# Altium project OTTO_ESP32.PrjPCB
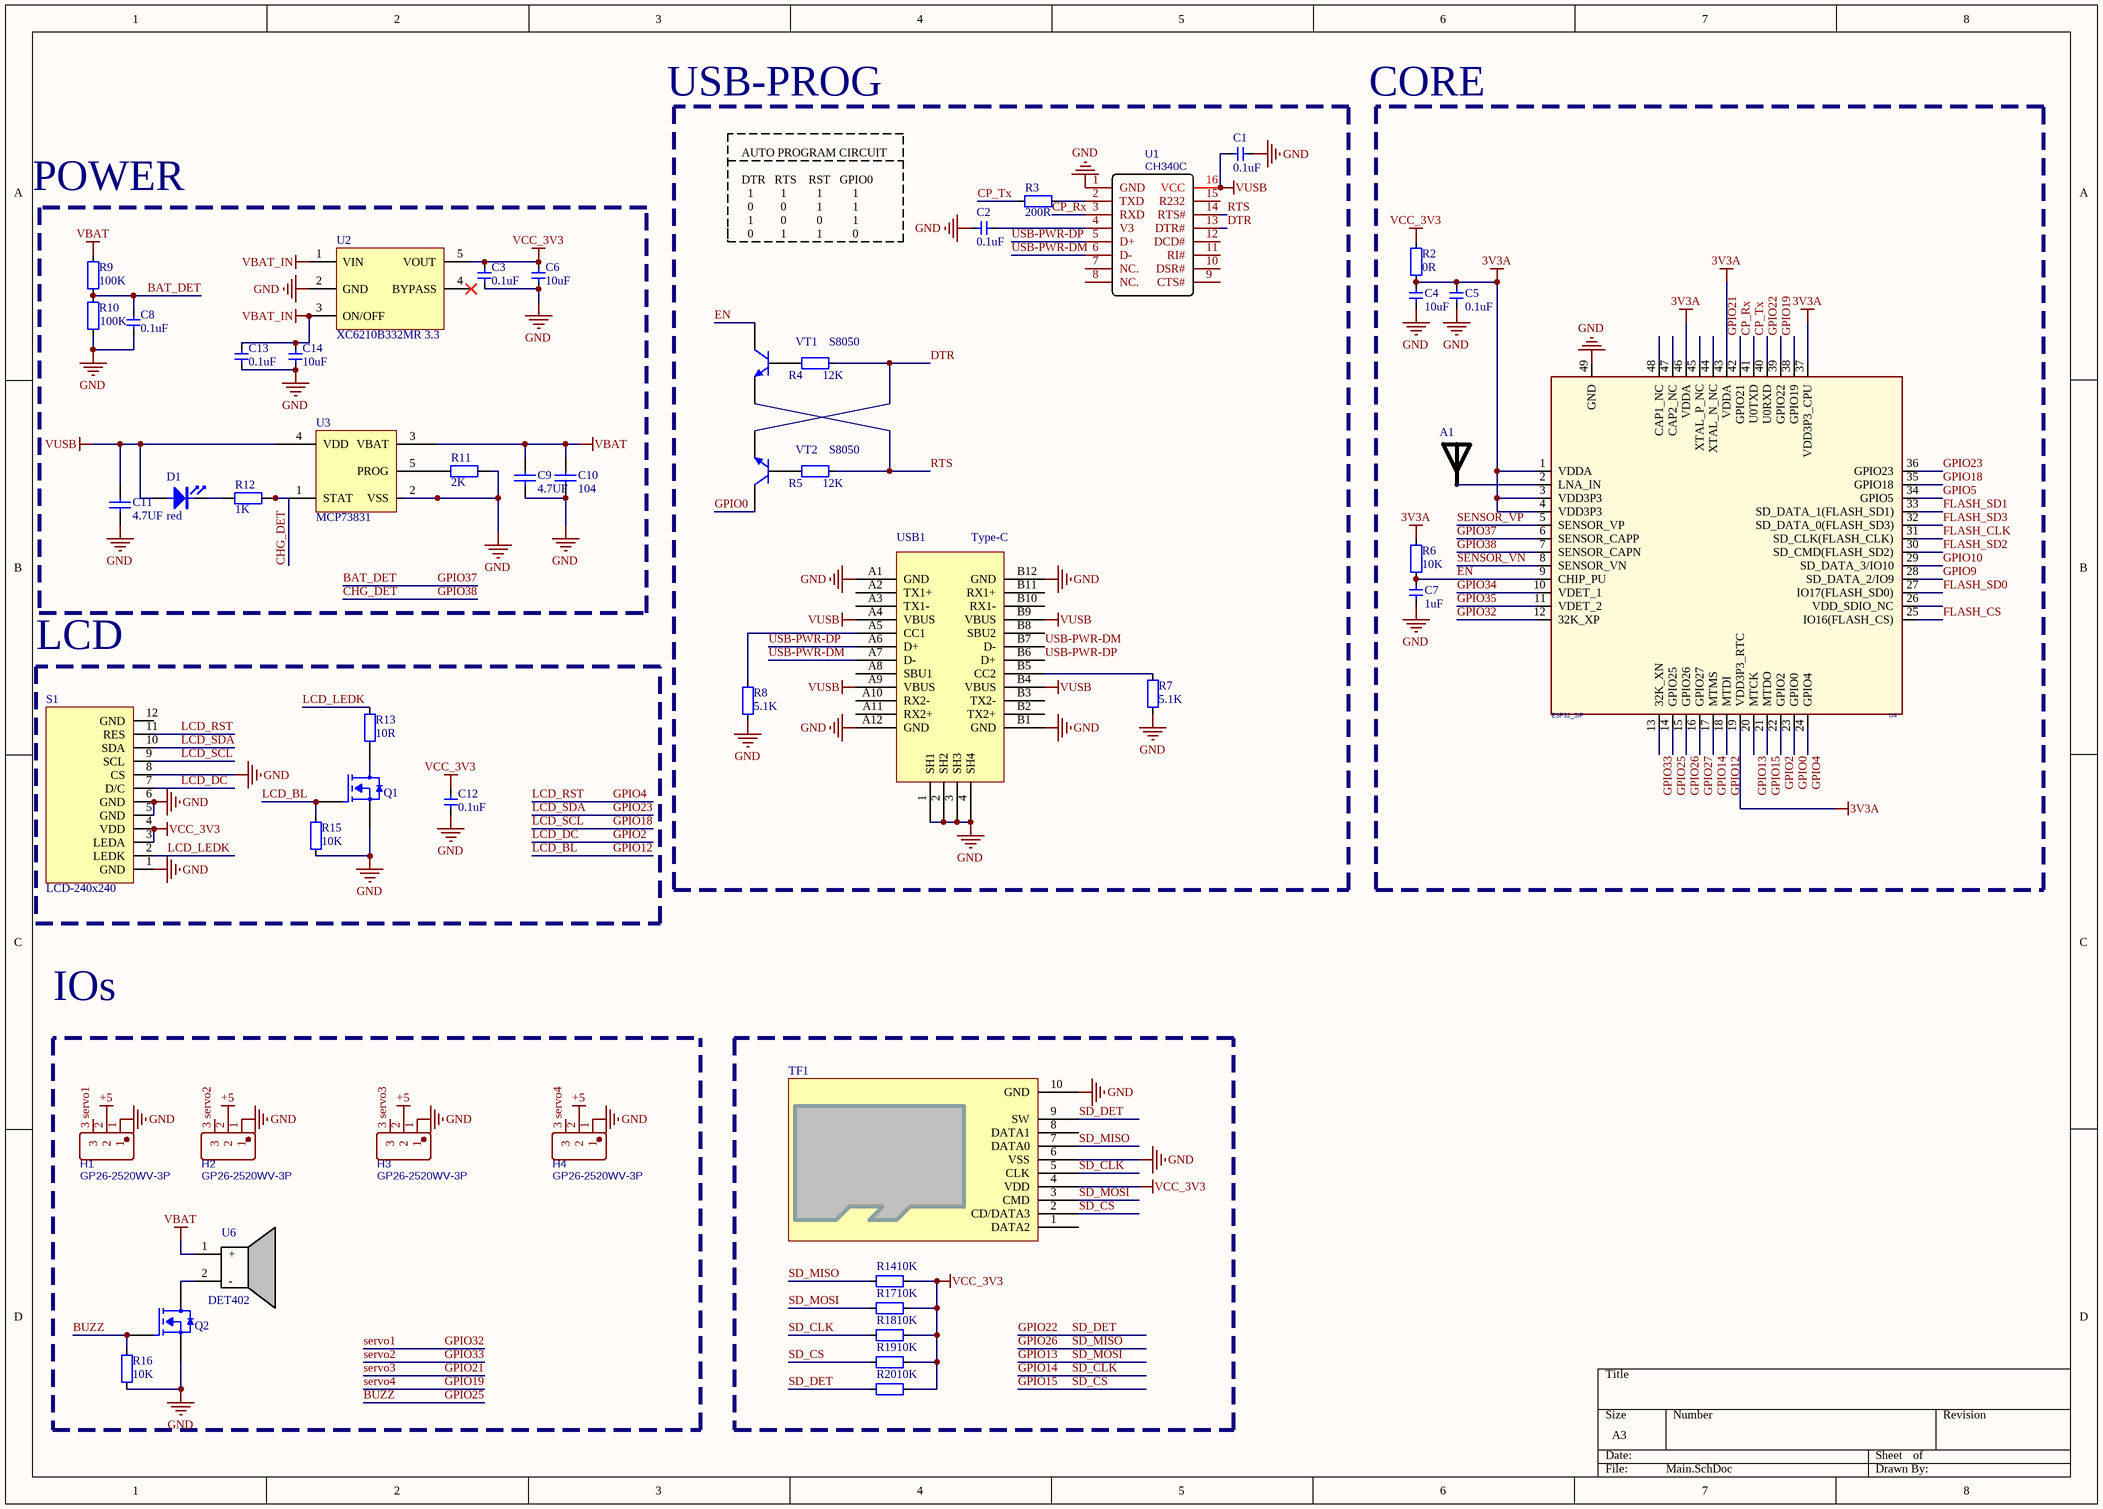
[diagram p0: Main.SchDoc]
1 sheet, 51 parts. Net scope: global (net labels, ports and power ports of the same name join across sheets).
Board file: OTTO_ESP32.PcbDoc

## Sheet Main.SchDoc
size A3

### Parts
A1  RAINSUN  [ANT-Rainsun-AN5120]  (value not drawn)
C1  0.1uF  [C0603]
C2  0.1uF  [C0603]
C3  0.1uF  [C0603]
C4  10uF  [C0603]
C5  0.1uF  [C0603]
C6  10uF  [C0603]
C7  1uF  [C0603]
C8  0.1uF  [C0603]
C9  4.7UF  [C0603]
C10  104  [C0603]
C11  4.7UF  [C0603]
C12  0.1uF  [C0603]
C13  0.1uF  [C0603]
C14  10uF  [C0603]
D1  red  [LED0603]
H1  GP26-2520WV-3P  [PIN2.54_1*3]
H2  GP26-2520WV-3P  [PIN2.54_1*3]
H3  GP26-2520WV-3P  [PIN2.54_1*3]
H4  GP26-2520WV-3P  [PIN2.54_1*3]
Q1  AO3400A  [SOT23-3]  (value not drawn)
Q2  AO3400A  [SOT23-3]  (value not drawn)
R2  0R  [R0603]
R3  200R  [R0603]
R4  12K  [R0603]
R5  12K  [R0603]
R6  10K  [R0603]
R7  5.1K  [R0603]
R8  5.1K  [R0603]
R9  100K  [R0603]
R10  100K  [R0603]
R11  2K  [R0603]
R12  1K  [R0603]
R13  10R  [R0603]
R14  10K  [R0603]
R15  10K  [R0603]
R16  10K  [R0603]
R17  10K  [R0603]
R18  10K  [R0603]
R19  10K  [R0603]
R20  10K  [R0603]
S1  LCD-240x240  [LCD-240x240-FlUSH-154]
TF1  TF  [TF-SOCKET]  (value not drawn)
U1  CH340C  [SOP-16_L10.0-W3.9-P1.27-LS6.0-BL]
U2  XC6210B332MR 3.3  [SOT23-5]
U3  MCP73831  [SOT23-5]
U4  ESP32_SIP  [QFN-48_7X7]
U6  DET402  [DET402]
USB1  Type-C  [Type-C-TOP]
VT1  S8050  [SOT23-3]
VT2  S8050  [SOT23-3]

### Nets
3V3A: C4.2 C5.2 R2.2 R6.1 U4.1(VDDA) U4.3(VDD3P3) U4.4(VDD3P3) U4.19(VDD3P3_RTC) U4.37(VDD3P3_CPU) U4.43(VDDA) U4.46(VDDA)
+5: H1.2 H2.2 H3.2 H4.2
GND: C1.1 C2.2 C3.1 C4.1 C5.1 C6.1 C7.2 C8.1 C9.1 C10.2 C11.1 C12.1 C13.1 C14.1 H1.1 H2.1 H3.1 H4.1 Q1.2(S) Q2.2(S) R7.2 R8.2 R10.1 R11.1 R15.1 R16.1 S1.1(GND) S1.5(GND) S1.6(GND) S1.8(CS) TF1.6(VSS) TF1.10(GND) U1.1(GND) U2.2(GND) U3.2(VSS) U4.49(GND) USB1.1(SH1) USB1.2(SH2) USB1.3(SH3) USB1.4(SH4) USB1.A1(GND) USB1.A12(GND) USB1.B1(GND) USB1.B12(GND)
VBAT: C9.2 C10.1 R9.2 U3.3(VBAT) U6.1(+)
VBAT_IN: C13.2 C14.2 U2.1(VIN) U2.3(ON/OFF)
VCC_3V3: C3.2 C6.2 C12.2 R2.1 R14.1 R17.1 R18.1 R19.1 R20.1 S1.3(LEDA) S1.4(VDD) TF1.4(VDD) U2.5(VOUT)
VUSB: C1.2 C11.2 D1.A U1.16(VCC) U3.4(VDD) USB1.A4(VBUS) USB1.A9(VBUS) USB1.B4(VBUS) USB1.B9(VBUS)
BAT_DET: C8.2 R9.1 R10.2 U4.6(SENSOR_CAPP)  [also labelled GPIO37]
BUZZ: Q2.1(G) R16.2 U4.14(GPIO25)  [also labelled GPIO25]
CHG_DET: R12.1 U3.1(STAT) U4.7(SENSOR_CAPN)  [also labelled GPIO38]
CP_Rx: U1.3(RXD) U4.41(U0TXD)
CP_Tx: R3.1 U4.40(U0RXD)
DTR: R4.1 U1.13(DTR#) VT2.2(E)
EN: C7.1 R6.2 U4.9(CHIP_PU) VT1.3(C)
FLASH_CLK: U4.31(SD_CLK(FLASH_CLK))
FLASH_CS: U4.25(IO16(FLASH_CS))
FLASH_SD0: U4.27(IO17(FLASH_SD0))
FLASH_SD1: U4.33(SD_DATA_1(FLASH_SD1))
FLASH_SD2: U4.30(SD_CMD(FLASH_SD2))
FLASH_SD3: U4.32(SD_DATA_0(FLASH_SD3))
GPIO0: U4.23(GPIO0) VT2.3(C)
GPIO2: S1.7(D/C) U4.22(GPIO2)  [also labelled LCD_DC]
GPIO4: S1.11(RES) U4.24(GPIO4)  [also labelled LCD_RST]
GPIO5: U4.34(GPIO5)
GPIO9: U4.28(SD_DATA_2/IO9)
GPIO10: U4.29(SD_DATA_3/IO10)
GPIO12: Q1.1(G) R15.2 U4.18(MTDI)  [also labelled LCD_BL]
GPIO13: R17.2 TF1.3(CMD) U4.20(MTCK)  [also labelled SD_MOSI]
GPIO14: R18.2 TF1.5(CLK) U4.17(MTMS)  [also labelled SD_CLK]
GPIO15: R19.2 TF1.2(CD/DATA3) U4.21(MTDO)  [also labelled SD_CS]
GPIO18: S1.9(SCL) U4.35(GPIO18)  [also labelled LCD_SCL]
GPIO19: H4.3 U4.38(GPIO19)  [also labelled servo4]
GPIO21: H3.3 U4.42(GPIO21)  [also labelled servo3]
GPIO22: R20.2 TF1.9(SW) U4.39(GPIO22)  [also labelled SD_DET]
GPIO23: S1.10(SDA) U4.36(GPIO23)  [also labelled LCD_SDA]
GPIO26: R14.2 TF1.7(DATA0) U4.15(GPIO26)  [also labelled SD_MISO]
GPIO27: U4.16(GPIO27)
GPIO32: H1.3 U4.12(32K_XP)  [also labelled servo1]
GPIO33: H2.3 U4.13(32K_XN)  [also labelled servo2]
GPIO34: U4.10(VDET_1)
GPIO35: U4.11(VDET_2)
LCD_LEDK: R13.2 S1.2(LEDK)
RTS: R5.1 U1.14(RTS#) VT1.2(E)
SENSOR_VN: U4.8(SENSOR_VN)
SENSOR_VP: U4.5(SENSOR_VP)
USB-PWR-DM: U1.6(D-) USB1.A7(D-) USB1.B7(D-)
USB-PWR-DP: U1.5(D+) USB1.A6(D+) USB1.B6(D+)
NetA1_1: A1.1 U4.2(LNA_IN)
NetC2_1: C2.1 U1.4(V3)
NetD1_K: D1.K R12.2
NetQ1_3: Q1.3(D) R13.1
NetQ2_3: Q2.3(D) U6.2(-)
NetR3_2: R3.2 U1.2(TXD)
NetR4_2: R4.2 VT1.1(B)
NetR5_2: R5.2 VT2.1(B)
NetR7_1: R7.1 USB1.B5(CC2)
NetR8_1: R8.1 USB1.A5(CC1)
NetR11_2: R11.2 U3.5(PROG)

Not connected (* = marked no-connect by the designer): S1 12(GND); TF1 1(DATA2) 8(DATA1); U1 7(NC.) 8(NC.) 9(CTS#) 10(DSR#) 11(RI#) 12(DCD#) 15(R232); U2 4(BYPASS)*; U4 26(VDD_SDIO_NC) 44(XTAL_N_NC) 45(XTAL_P_NC) 47(CAP2_NC) 48(CAP1_NC); USB1 A2(TX1+) A3(TX1-) A8(SBU1) A10(RX2-) A11(RX2+) B2(TX2+) B3(TX2-) B8(SBU2) B10(RX1-) B11(RX1+)

### Notes on the sheet
- USB-PROG
- CORE
- POWER
- AUTO PROGRAM CIRCUIT
  DTR   RTS    RST   GPIO0
  1         1          1          1
  0         0          1          1
  1         0          0          1
  0         1          1          0
- LCD
- IOs

### Library data of the parts
A1 = ANT-Rainsun-AP5120
C1-C8 C12-C14 = 电容-0402: Capacitor; Value: 0.1u
C9-C11 = cap: U: 50V; 参数: Cap,0805,X7R,104K,50V,125C,±10%
  C9 C11: C: 4.7UF
  C10: C: 104
D1 = LED: pin to pad: A>1 K>2; 参数: LED,0603,Red
H1-H4 = GP26-2520WV-3P: BOM_Manufacturer: GEPU(歌普); Contributor: LCSC; BOM_Supplier: LCSC; BOM_Supplier Part: C2681738; BOM_Manufacturer Part: GP26-2520WV-3P; BOM_JLCPCB Part Class: Extended Part; spicePre: H; spiceSymbolName: GP26-2520WV-3P
Q1 Q2 = AO3400A: N-MOS
R2-R10 R13-R20 = 电阻-0402: Resistor; Value: 22R
R11 R12 = Res: P: 1/8W; 参数: Res,0805,0R,±1%,1/8W,100ppm,155C
  R11: R: 2K
  R12: R: 1K
S1 = LCD-240x240: 显示屏
TF1 = TF卡座: 8脚自弹
U1 = CH340C: BOM_Manufacturer: WCH; BOM_Supplier: LCSC; BOM_Manufacturer Part: CH340C; BOM_Supplier Part: C84681; BOM_JLCPCB Part Class: Extended Part; spicePre: U; spiceSymbolName: CH340C
U2 = LP2992: LDO
U3 = MCP73831: 线性充电管理控制器
U4 = ESP32-PICO
USB1 = USB-Type-C-TOP
VT1 VT2 = SMT_TRIODE_NPN: Surface mount NPN transistor, package SOT-23